# EAGLE design Pi Header (EAGLE 7.5.0)
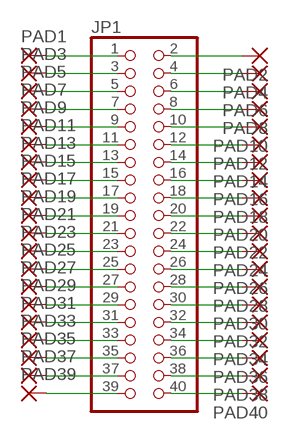
[diagram p0: schematic, sheet 1]

## Parts
JP1  PINHD-2X20-BIG  [2X20-BIG]
PAD1  1,6/0,8  [1,6/0,8]
PAD2  1,6/0,8  [1,6/0,8]
PAD3  1,6/0,8  [1,6/0,8]
PAD4  1,6/0,8  [1,6/0,8]
PAD5  1,6/0,8  [1,6/0,8]
PAD6  1,6/0,8  [1,6/0,8]
PAD7  1,6/0,8  [1,6/0,8]
PAD8  1,6/0,8  [1,6/0,8]
PAD9  1,6/0,8  [1,6/0,8]
PAD10  1,6/0,8  [1,6/0,8]
PAD11  1,6/0,8  [1,6/0,8]
PAD12  1,6/0,8  [1,6/0,8]
PAD13  1,6/0,8  [1,6/0,8]
PAD14  1,6/0,8  [1,6/0,8]
PAD15  1,6/0,8  [1,6/0,8]
PAD16  1,6/0,8  [1,6/0,8]
PAD17  1,6/0,8  [1,6/0,8]
PAD18  1,6/0,8  [1,6/0,8]
PAD19  1,6/0,8  [1,6/0,8]
PAD20  1,6/0,8  [1,6/0,8]
PAD21  1,6/0,8  [1,6/0,8]
PAD22  1,6/0,8  [1,6/0,8]
PAD23  1,6/0,8  [1,6/0,8]
PAD24  1,6/0,8  [1,6/0,8]
PAD25  1,6/0,8  [1,6/0,8]
PAD26  1,6/0,8  [1,6/0,8]
PAD27  1,6/0,8  [1,6/0,8]
PAD28  1,6/0,8  [1,6/0,8]
PAD29  1,6/0,8  [1,6/0,8]
PAD30  1,6/0,8  [1,6/0,8]
PAD31  1,6/0,8  [1,6/0,8]
PAD32  1,6/0,8  [1,6/0,8]
PAD33  1,6/0,8  [1,6/0,8]
PAD34  1,6/0,8  [1,6/0,8]
PAD35  1,6/0,8  [1,6/0,8]
PAD36  1,6/0,8  [1,6/0,8]
PAD37  1,6/0,8  [1,6/0,8]
PAD38  1,6/0,8  [1,6/0,8]
PAD39  1,6/0,8  [1,6/0,8]
PAD40  1,6/0,8  [1,6/0,8]

## Nets
N$1: JP1.1 PAD1.1(P)
N$2: JP1.3 PAD3.1(P)
N$3: JP1.5 PAD5.1(P)
N$4: JP1.7 PAD7.1(P)
N$5: JP1.9 PAD9.1(P)
N$6: JP1.11 PAD11.1(P)
N$7: JP1.13 PAD13.1(P)
N$8: JP1.15 PAD15.1(P)
N$9: JP1.17 PAD17.1(P)
N$10: JP1.19 PAD19.1(P)
N$11: JP1.21 PAD21.1(P)
N$12: JP1.23 PAD23.1(P)
N$13: JP1.25 PAD25.1(P)
N$14: JP1.27 PAD27.1(P)
N$15: JP1.29 PAD29.1(P)
N$16: JP1.31 PAD31.1(P)
N$17: JP1.33 PAD33.1(P)
N$18: JP1.35 PAD35.1(P)
N$19: JP1.37 PAD37.1(P)
N$20: JP1.39 PAD39.1(P)
N$21: JP1.40 PAD40.1(P)
N$22: JP1.38 PAD38.1(P)
N$23: JP1.36 PAD36.1(P)
N$24: JP1.34 PAD34.1(P)
N$25: JP1.32 PAD32.1(P)
N$26: JP1.30 PAD30.1(P)
N$27: JP1.28 PAD28.1(P)
N$28: JP1.26 PAD26.1(P)
N$29: JP1.24 PAD24.1(P)
N$30: JP1.22 PAD22.1(P)
N$31: JP1.20 PAD20.1(P)
N$32: JP1.18 PAD18.1(P)
N$33: JP1.16 PAD16.1(P)
N$34: JP1.14 PAD14.1(P)
N$35: JP1.12 PAD12.1(P)
N$36: JP1.10 PAD10.1(P)
N$37: JP1.8 PAD8.1(P)
N$38: JP1.6 PAD6.1(P)
N$39: JP1.4 PAD4.1(P)
N$40: JP1.2 PAD2.1(P)

## Library data of the parts
JP1 = adafruit:PINHD-2X20: PIN HEADER
PAD1-PAD40 = wirepad:1,6/0,8: THROUGH-HOLE PAD

## Board
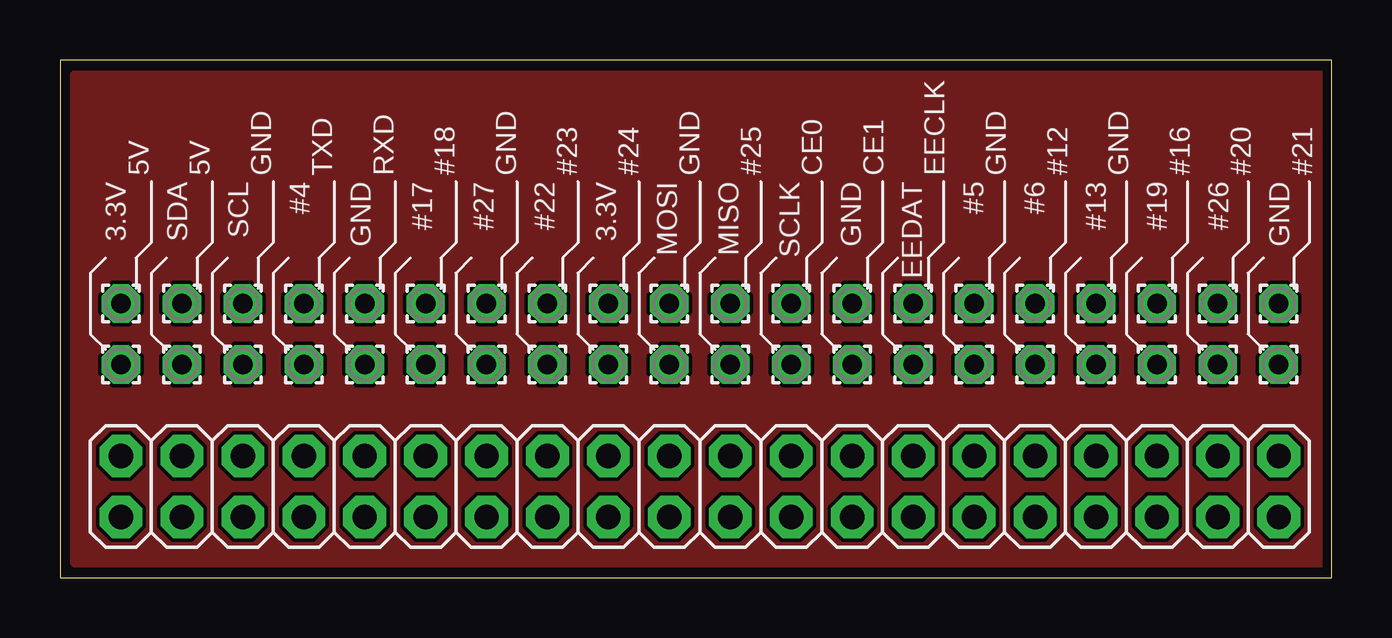
[diagram p1: board, top side]
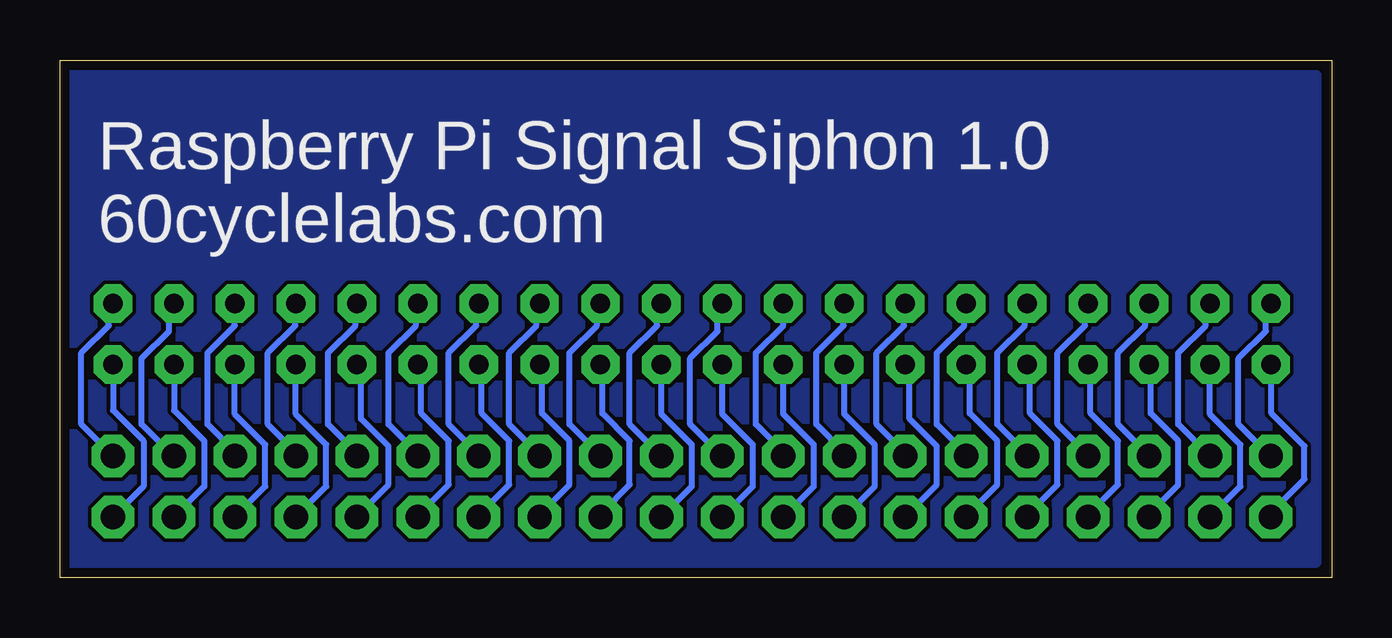
[diagram p2: board, bottom side, seen from below]

Size 53.01 x 21.58 mm. Coordinates in mm from the lower left corner, seen from the top.
Outline: 0,0 53.01,0 53.01,21.58 0,21.58 0,0
Copper layers (1*16): Top 0.0356mm / dielectric 1.5011mm / Bottom 0.0356mm
Design rules "LaenPCBOrder": minimum track width 6mil, minimum drill 13mil, track to track 6mil, track to pad 6mil, pad to pad 6mil, via to via 6mil, smd to smd 6mil, copper to edge 15mil, drill to drill 6mil, minimum pad ring 7mil, minimum via ring 7mil, stop-mask expansion 3mil, vias tented up to drill 0mil, thermal gap 10mil

### Footprints (pad centres in the part's own frame; a part is rotated, then mirrored left to right if it is on the bottom)
2X20-BIG = drill 1.016 pad 1.778 octagon: 1 -24.13,-1.27; 2 -24.13,1.27; 3 -21.59,-1.27; 4 -21.59,1.27; 5 -19.05,-1.27; 6 -19.05,1.27; 7 -16.51,-1.27; 8 -16.51,1.27; 9 -13.97,-1.27; 10 -13.97,1.27; 11 -11.43,-1.27; 12 -11.43,1.27; 13 -8.89,-1.27; 14 -8.89,1.27; 15 -6.35,-1.27; 16 -6.35,1.27; 17 -3.81,-1.27; 18 -3.81,1.27; 19 -1.27,-1.27; 20 -1.27,1.27; 21 1.27,-1.27; 22 1.27,1.27; 23 3.81,-1.27; 24 3.81,1.27; 25 6.35,-1.27; 26 6.35,1.27; 27 8.89,-1.27; 28 8.89,1.27; 29 11.43,-1.27; 30 11.43,1.27; 31 13.97,-1.27; 32 13.97,1.27; 33 16.51,-1.27; 34 16.51,1.27; 35 19.05,-1.27; 36 19.05,1.27; 37 21.59,-1.27; 38 21.59,1.27; 39 24.13,-1.27; 40 24.13,1.27
1,6/0,8 = drill 0.813 pad 1.6 octagon: 1 0,0

### Placement (x,y rotation side)
JP1  26.67,3.81 0 top
PAD1  2.54,8.89 0 top
PAD2  2.54,11.43 0 top
PAD3  5.08,8.89 0 top
PAD4  5.08,11.43 0 top
PAD5  7.62,8.89 0 top
PAD6  7.62,11.43 0 top
PAD7  10.16,8.89 0 top
PAD8  10.16,11.43 0 top
PAD9  12.7,8.89 0 top
PAD10  12.7,11.43 0 top
PAD11  15.24,8.89 0 top
PAD12  15.24,11.43 0 top
PAD13  17.78,8.89 0 top
PAD14  17.78,11.43 0 top
PAD15  20.32,8.89 0 top
PAD16  20.32,11.43 0 top
PAD17  22.86,8.89 0 top
PAD18  22.86,11.43 0 top
PAD19  25.4,8.89 0 top
PAD20  25.4,11.43 0 top
PAD21  27.94,8.89 0 top
PAD22  27.94,11.43 0 top
PAD23  30.48,8.89 0 top
PAD24  30.48,11.43 0 top
PAD25  33.02,8.89 0 top
PAD26  33.02,11.43 0 top
PAD27  35.56,8.89 0 top
PAD28  35.56,11.43 0 top
PAD29  38.1,8.89 0 top
PAD30  38.1,11.43 0 top
PAD31  40.64,8.89 0 top
PAD32  40.64,11.43 0 top
PAD33  43.18,8.89 0 top
PAD34  43.18,11.43 0 top
PAD35  45.72,8.89 0 top
PAD36  45.72,11.43 0 top
PAD37  48.26,8.89 0 top
PAD38  48.26,11.43 0 top
PAD39  50.8,8.89 0 top
PAD40  50.8,11.43 0 top

### Tracks (layer width: path | path; a pad name or v marks a point on that pad's centre or on a via)
GND
  pour Top: 0.64,20.95 52.7,20.95 52.7,0.64 0.64,0.64
  pour Bottom: 0.64,20.95 52.7,20.95 52.7,0.64 0.64,0.64 0.64,1.27
N$1
  Bottom 0.254: PAD1.1 2.52,8.69 2.52,6.86 1.14,5.49 1.14,4.12 2.52,2.74 JP1.1
N$2
  Bottom 0.254: PAD3.1 5.08,6.83 3.81,5.56 3.81,3.81 JP1.3
N$3
  Bottom 0.254: PAD5.1 7.54,8.69 7.54,6.86 6.4,5.71 6.4,3.89 7.54,2.74 JP1.5
N$4
  Bottom 0.254: PAD7.1 10.06,8.69 10.06,6.86 8.91,5.71 8.91,3.89 10.06,2.74 JP1.7
N$5
  Bottom 0.254: PAD9.1 12.57,8.69 12.57,6.86 11.43,5.71 11.43,3.89 12.57,2.74 JP1.9
N$6
  Bottom 0.254: PAD11.1 15.09,8.69 15.09,6.86 13.95,5.71 13.95,3.89 15.09,2.74 JP1.11
N$7
  Bottom 0.254: PAD13.1 17.6,8.69 17.6,6.63 16.46,5.49 16.46,3.89 17.6,2.74 JP1.13
N$8
  Bottom 0.254: PAD15.1 20.32,6.83 19.05,5.56 19.05,3.81 JP1.15
N$9
  Bottom 0.254: PAD17.1 22.86,6.83 21.59,5.56 21.59,3.81 JP1.17
N$10
  Bottom 0.254: PAD19.1 25.4,6.83 24.13,5.56 24.13,3.81 JP1.19
N$11
  Bottom 0.254: PAD21.1 27.94,6.83 26.67,5.56 26.67,3.81 JP1.21
N$12
  Bottom 0.254: PAD23.1 30.4,8.69 30.4,6.86 29.26,5.71 29.26,3.89 30.4,2.74 JP1.23
N$13
  Bottom 0.254: PAD25.1 32.92,8.69 32.92,6.86 31.77,5.71 31.77,3.89 32.92,2.74 JP1.25
N$14
  Bottom 0.254: PAD27.1 35.43,8.69 35.43,6.86 34.29,5.71 34.29,3.89 35.43,2.74 JP1.27
N$15
  Bottom 0.254: PAD29.1 37.95,8.69 37.95,6.86 36.8,5.71 36.8,3.89 37.95,2.74 JP1.29
N$16
  Bottom 0.254: PAD31.1 40.46,8.69 40.46,6.63 39.32,5.49 39.32,3.89 40.46,2.74 JP1.31
N$17
  Bottom 0.254: PAD33.1 43.18,6.83 41.91,5.56 41.91,3.81 JP1.33
N$18
  Bottom 0.254: PAD35.1 45.72,6.83 44.45,5.56 44.45,3.81 JP1.35
N$19
  Bottom 0.254: PAD37.1 48.26,6.99 46.99,5.71 46.99,3.81 JP1.37
N$20
  Bottom 0.254: PAD39.1 50.8,6.99 49.53,5.71 49.53,3.81 JP1.39
N$21
  Bottom 0.254: JP1.40 52.12,6.4 52.12,9.37 50.98,10.52 50.98,11.43 PAD40.1
N$22
  Bottom 0.254: PAD38.1 48.46,11.43 48.46,10.29 49.61,9.14 49.61,6.4 48.46,5.26 JP1.38
N$23
  Bottom 0.254: PAD36.1 45.72,10.52 46.86,9.37 46.86,6.4 45.72,5.26 JP1.36
N$24
  Bottom 0.254: PAD34.1 43.2,11.43 43.2,10.52 44.35,9.37 44.35,6.4 43.2,5.26 JP1.34
N$25
  Bottom 0.254: PAD32.1 40.69,11.43 40.69,10.52 41.83,9.37 41.83,6.4 40.69,5.26 JP1.32
N$26
  Bottom 0.254: PAD30.1 38.18,11.43 38.18,10.52 39.32,9.37 39.32,6.4 38.18,5.26 JP1.30
N$27
  Bottom 0.254: PAD28.1 35.66,11.43 35.66,10.52 36.8,9.37 36.8,6.4 35.66,5.26 JP1.28
N$28
  Bottom 0.254: PAD26.1 33.15,11.43 33.15,10.52 34.29,9.37 34.29,6.4 33.15,5.26 JP1.26
N$29
  Bottom 0.254: PAD24.1 30.63,11.43 30.63,10.52 31.77,9.37 31.77,6.4 30.63,5.26 JP1.24
N$30
  Bottom 0.254: JP1.22 29.26,6.4 29.26,9.37 28.12,10.52 28.12,11.43 PAD22.1
N$31
  Bottom 0.254: PAD20.1 25.6,11.43 25.6,10.29 26.75,9.14 26.75,6.4 25.6,5.26 JP1.20
N$32
  Bottom 0.254: PAD18.1 22.86,10.52 24,9.37 24,6.4 22.86,5.26 JP1.18
N$33
  Bottom 0.254: PAD16.1 20.34,11.43 20.34,10.52 21.49,9.37 21.49,6.4 20.34,5.26 JP1.16
N$34
  Bottom 0.254: PAD14.1 17.83,11.43 17.83,10.52 18.97,9.37 18.97,6.4 17.83,5.26 JP1.14
N$35
  Bottom 0.254: PAD12.1 15.32,11.43 15.32,10.52 16.46,9.37 16.46,6.4 15.32,5.26 JP1.12
N$36
  Bottom 0.254: PAD10.1 12.8,11.43 12.8,10.52 13.95,9.37 13.95,6.4 12.8,5.26 JP1.10
N$37
  Bottom 0.254: PAD8.1 10.29,11.43 10.29,10.52 11.43,9.37 11.43,6.4 10.29,5.26 JP1.8
N$38
  Bottom 0.254: PAD6.1 7.77,11.43 7.77,10.52 8.91,9.37 8.91,6.4 7.77,5.26 JP1.6
N$39
  Bottom 0.254: JP1.4 6.4,6.4 6.4,9.37 5.26,10.52 5.26,11.43 PAD4.1
N$40
  Bottom 0.254: PAD2.1 2.74,11.43 2.74,10.29 3.89,9.14 3.89,6.4 2.74,5.26 JP1.2

### Text on the board
tPlace: 3.3V / / SDA / / SCL / / #4 / / GND / / #17 / / #27 / / #22 / / 3.3V / / MOSI / / MISO / / SCLK / / GND / / EEDAT / / #5 / / #6 / / #13 / / #19 / / #26 / / GND | 5V / / 5V / / GND / / TXD / / RXD / / #18 / / GND / / #23 / / #24 / / GND / / #25 / / CE0 / / CE1 / / EECLK / / GND / / #12 / / GND / / #16 / / #20 / / #21
bPlace: Raspberry Pi Signal Siphon 1.0 / 60cyclelabs.com